# Altium schematic sheet AMU-S03-V00-PSU3V5.SchDoc: Power Supply (20-40V to 3v3 @ 0.1-0.6A)
size A3; DrawnBy: Jonn Dillon; DocumentNumber: 3; SheetNumber: 3; SheetTotal: 23; Version: 00; Project: AMU 2020 (Sourced from BMS 2020); PageSetup: Record=PageOptions|CenterHorizontal=True|CenterVertical=True|PrintScale=0.97|XCorrection=1.00|YCorrection=1.00|PrintKind=0|BorderSize=5000000|LeftOffset=0|BottomOffset=0|Orientation=2|PaperLength=1000|PaperWidth=1000|Scale=100|PaperSource=7|PrintQuality=-4|MediaType=1|DitherType=10|PaperKind=A4|PrintScaleMode=1
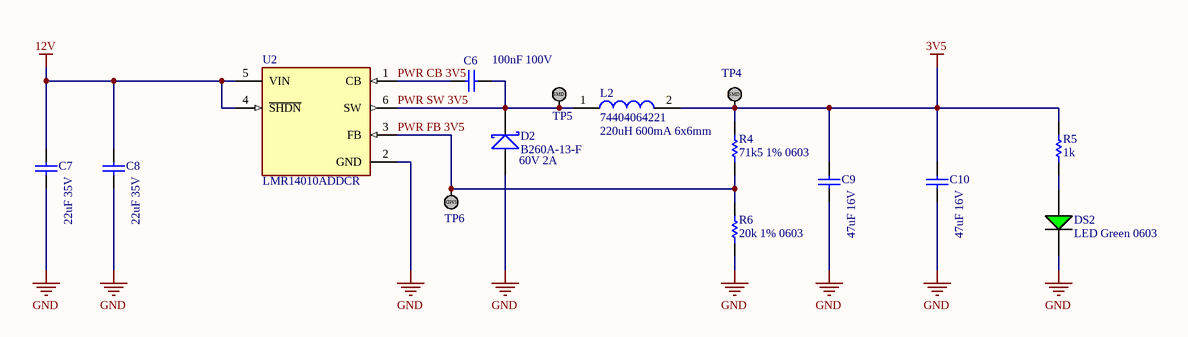
[diagram p0: AMU-S03-V00-PSU3V5.SchDoc]

## Parts
C6  100nF 100V  [Cap_Ceramic_0603]
C7  22uF 35V  [Cap_Ceramic_1206]
C8  22uF 35V  [Cap_Ceramic_1206]
C9  47uF 16V  [Cap_Ceramic_0603]
C10  47uF 16V  [Cap_Ceramic_0603]
D2  B260A-13-F  [SMA]
DS2  LED Green 0603  [LED GREEN 0603]
L2  74404064221  [Inductor_6x6mm]
R4  71k5 1% 0603  [Res_ThinFilm_0603]
R5  1k  [Res_ThinFilm_0603]
R6  20k 1% 0603  [Res_ThinFilm_0603]
TP4  TestPoint_SMD  [TestPointSMD]  (value not drawn)
TP5  TestPoint_SMD  [TestPointSMD]  (value not drawn)
TP6  TestPoint_SMD  [TestPointSMD]  (value not drawn)
U2  LMR14010ADDCR  [FP-DDC0006A-MFG]

## Nets
3V5: C9.2 C10.2 L2.2 R4.2 R5.2 TP4.1
12V: C7.2 C8.2 U2.4(~{SHDN}) U2.5(VIN)
GND: C7.1 C8.1 C9.1 C10.1 D2.A DS2.2(C) R6.1 U2.2(GND)
PWR CB 3V5: C6.1 U2.1(CB)
PWR FB 3V5: R4.1 R6.2 TP6.1 U2.3(FB)
PWR SW 3V5: C6.2 D2.K L2.1 TP5.1 U2.6(SW)
NetDS2_1: DS2.1(A) R5.1

## Notes on the sheet
- (near D2) 60V 2A
- (near L2) 220uH 600mA 6x6mm
- Revision History:
- Sheet Title:
- Rev
- Date
- Description
- Project:
- Size:
- Drawn By:
- A3
- Number:
- Revision:
- Sheet
- Version:
- of
- QUT Motorsport
- O-120, Gardens Point
- 2 George Street
- Brisbane, QLD 4000
- Australia
- Print Date:
- Print Time:
- File Name:
- (in symbol TestPoint_SMD) SMD

## Library data of the parts
C6 = 100nF 100V 5% X7R 0603: Capacitor, Ceramic, SMD, 100nF, 100V, 5%, X7R, 0603
C7 C8 = 22uF 35V 20% X5R 1206: 22µF ±20% 35V Ceramic Capacitor X5R 1206 (3216 Metric); ComponentLink1Description: Digikey; ComponentLink1URL: https://www.digikey.com.au/product-detail/en/tdk-corporation/C3216X5R1V226M160AC/445-8045-1-ND/2792165; ComponentLink2Description: Datasheet; ComponentLink2URL: https://product.tdk.com/info/en/catalog/datasheets/mlcc_commercial_general_en.pdf
C9 C10 = 47uF 16V 10% X7R 1210: Capacitor, Ceramic, SMD, 47uF, 16V, 5%, X7R, 1210
D2 = B260A-13-F: Diode, Schottky Barrier Rectifier, 60 V, 2 A, B260A-13-F
L2 = 74404064221: FIXED IND 220UH 660MA 850 MOHM; ComponentLink1Description: Digikey; ComponentLink1URL: https://www.digikey.com.au/product-detail/en/w%C3%BCrth-elektronik/74404064221/732-7261-1-ND/5353241; ComponentLink2Description: LCSC A; ComponentLink2URL: https://lcsc.com/product-detail/Power-Inductors_Sunlord-SWPA6045S221MT_C91047.html; ComponentLink3Description: LCSC B; ComponentLink3URL: https://lcsc.com/product-detail/Power-Inductors_SXN-Shun-Xiang-Nuo-Elec-SMNR6045-221MT_C467145.html
R4 = 71k5 1% 0603: Resistor, SMD, 71k5, 0.1W, 1%, 0603
R5 = 1k 5% 0603: Resistor, SMD, 1k, 0.1W, 5%, 0603
R6 = 20k 1% 0603: Resistor, SMD, 20k, 0.1W, 1%, 0603
U2 = CMP-04918-000056-1: IC REG BUCK ADJ 1A TSOT23-6; Manufacturer: Texas Instruments; Max Junction Temp: +125°C; Number Of Outputs: 1; Standoff Height: 0mm; Switching Frequency: 700kHz; Min Supply Voltage: 4V; Max Supply Voltage: 40V; Max Duty Cycle: 96%; Output Type: AdjustableProgrammable; Manufacturer Part Number: LMR14010ADDCR; Temperature: -40°C to +125°C; Output Current: 1A; Category: IC; Temperature Range High: +125°C; Lead Free: Yes; Switching Topology: Buck; Mouser Description: 4-V to 40-V, 1-A Step-Down Converter With High Efficiency Eco-Mode 6-SOT-23-THIN -40 to 125; Device Class L1: Integrated Circuits (ICs); Digikey Description: IC REG BUCK ADJ 1A TSOT23-6; Package: DDC0006A; Ipc Land Pattern Name: SOT95P280X110-6; Device Class L2: Power Management ICs; Temperature Range Low: -40°C; Height: 1.1mm; Device Class L3: Voltage Regulators - Switching; RoHS: TRUE; Automotive: No; Octopart: https://octopart.com/lmr14010addcr-texas+instruments-90753290; ComponentLink2URL: https://www.ti.com/lit/ds/symlink/lmr14010a.pdf; ComponentLink2Description: Datasheet